# Altium schematic sheet 425AK01A_S03.SchDoc
size A3; DocumentNumber: 3; SheetNumber: 3; SheetTotal: 10; PageSetup: Record=PageOptions|CenterHorizontal=True|CenterVertical=True|PrintScale=1.01|XCorrection=1.00|YCorrection=1.00|PrintKind=1|BorderSize=5000000|LeftOffset=0|BottomOffset=0|Orientation=2|PaperLength=1000|PaperWidth=1000|Scale=100|PaperSource=15|PrintQuality=600|MediaType=1|DitherType=10|PaperKind=A3|PrintScaleMode=1; 00_Drawn: RJG; 00_Date: 11AUG2022; 00_Checked: SR; 00_Approved: GN; 00_Line1: RSB A 10MHz/50MHz Input Paths
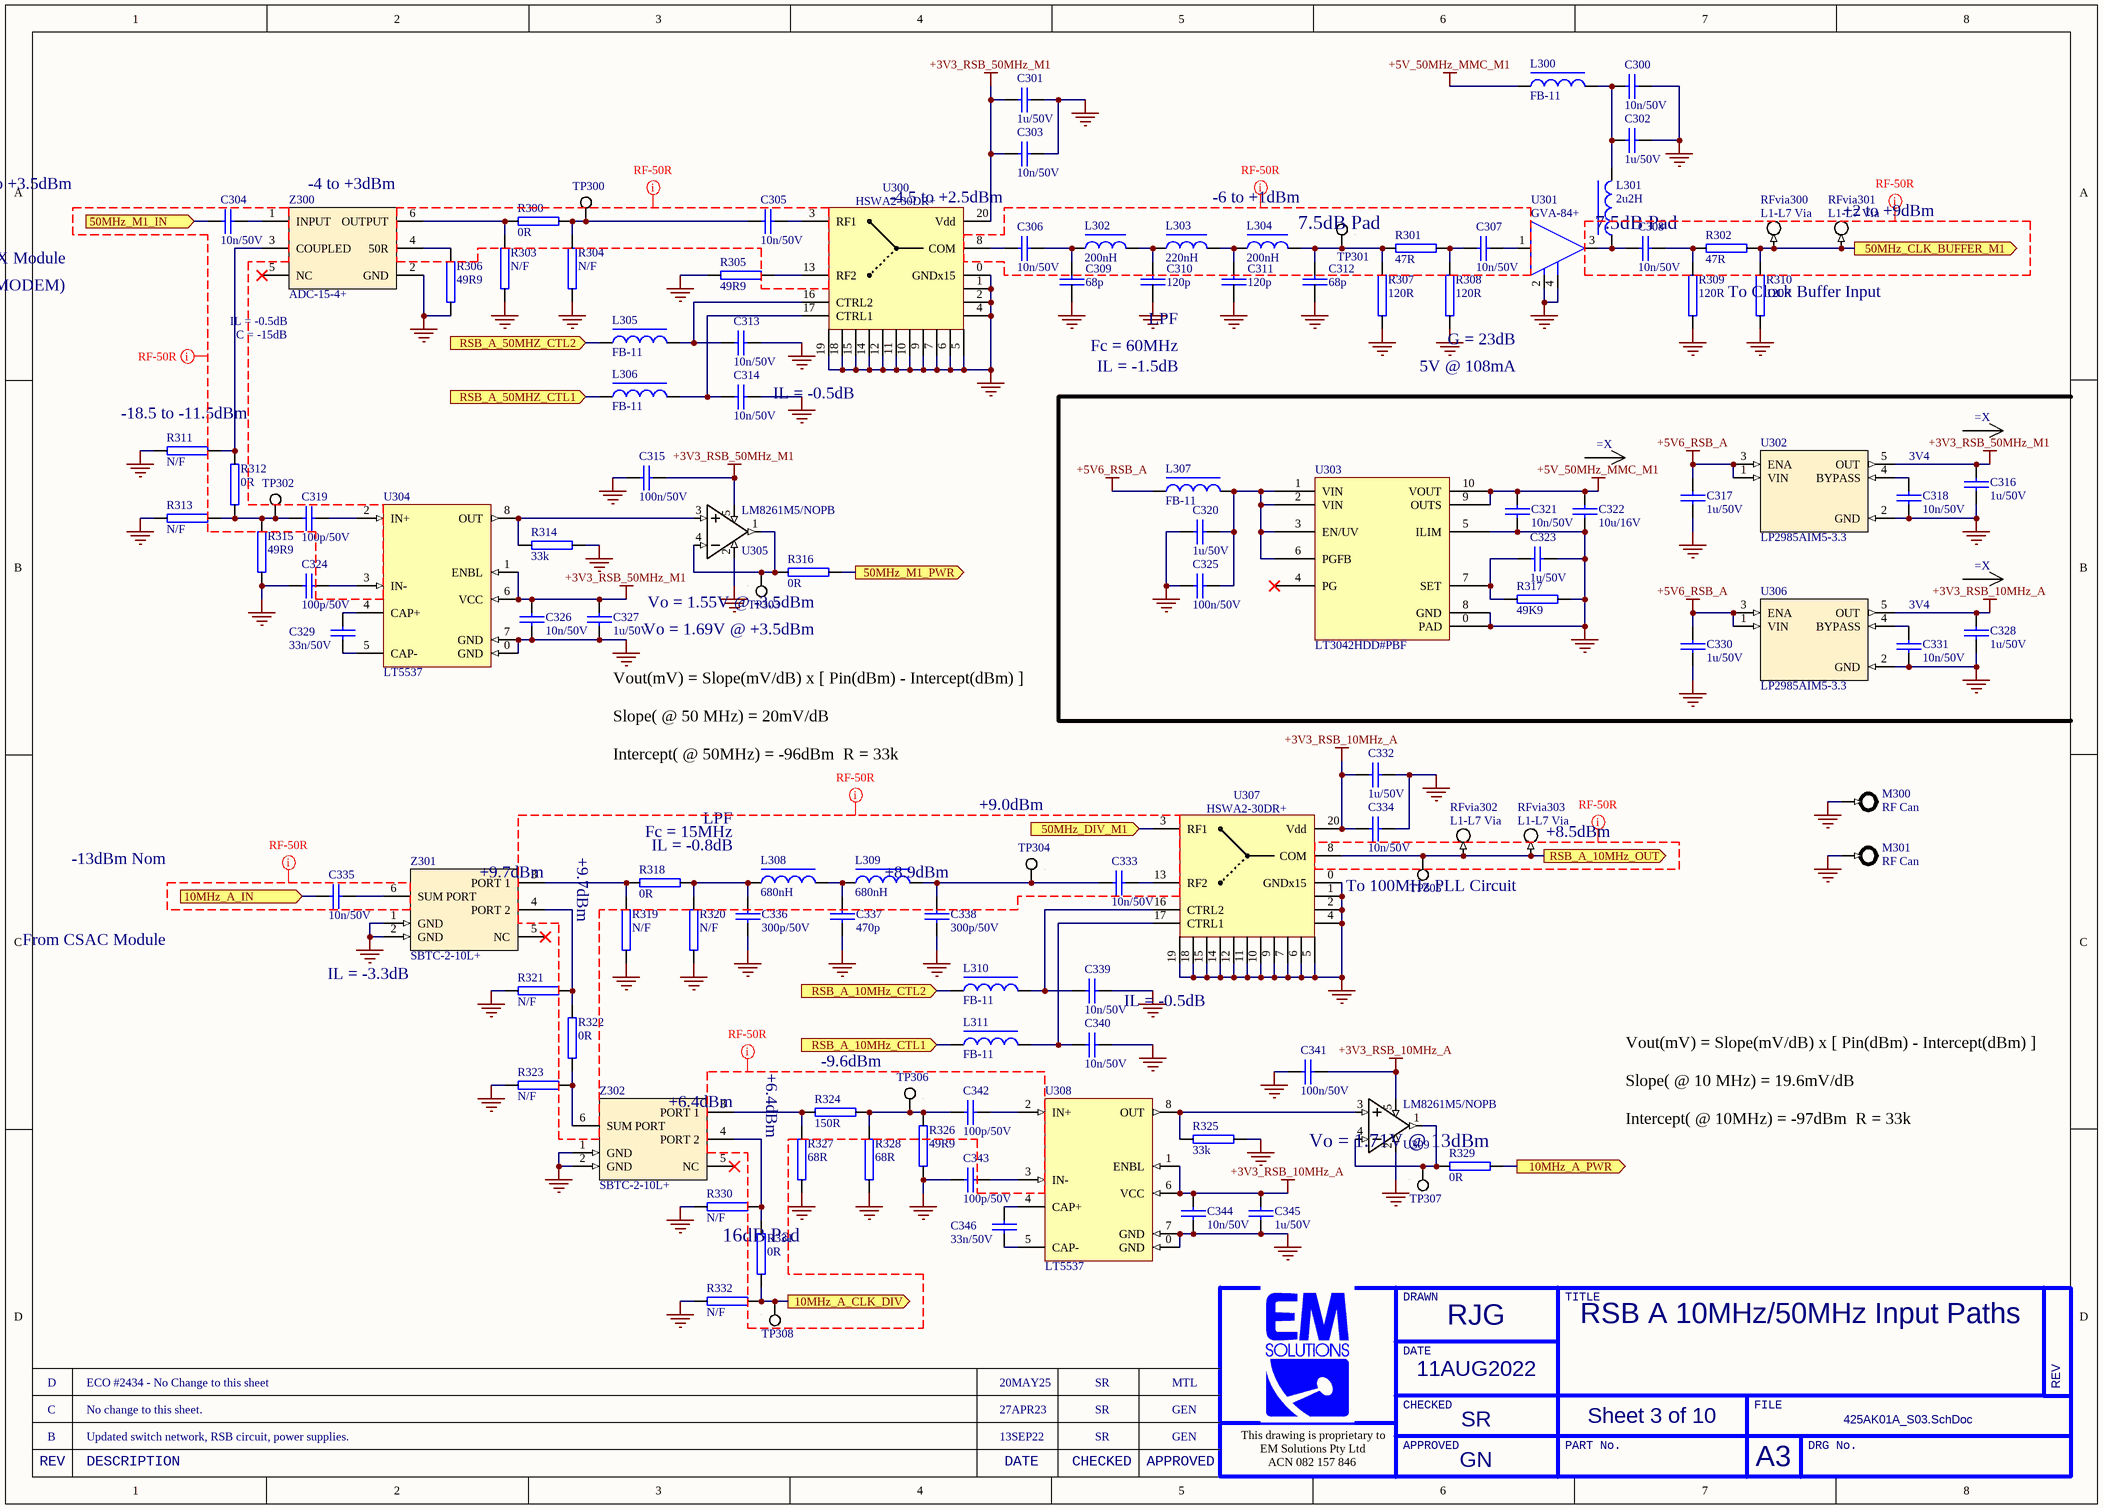
[diagram p0: 425AK01A_S03.SchDoc]

## Parts
(Parts that share a designator on the sheet are numbered #1, #2 ... from top to bottom, then left to right.)
C300  10n/50V  [0402C]
C301  1u/50V  [0603C]
C302  1u/50V  [0603C]
C303  10n/50V  [0402C]
C304  10n/50V  [0402C]
C305  10n/50V  [0402C]
C306  10n/50V  [0402C]
C307  10n/50V  [0402C]
C308  10n/50V  [0402C]
C309  68p  [0402C]
C310  120p  [0402C]
C311  120p  [0402C]
C312  68p  [0402C]
C313  10n/50V  [0402C]
C314  10n/50V  [0402C]
C315  100n/50V  [0402C]
C316  1u/50V  [0603C]
C317  1u/50V  [0603C]
C318  10n/50V  [0402C]
C319  100p/50V  [0402C]
C320  1u/50V  [0603C]
C321  10n/50V  [0402C]
C322  10u/16V  [0805C]
C323  1u/50V  [0603C]
C324  100p/50V  [0402C]
C325  100n/50V  [0402C]
C326  10n/50V  [0402C]
C327  1u/50V  [0603C]
C328  1u/50V  [0603C]
C329  33n/50V  [0402C]
C330  1u/50V  [0603C]
C331  10n/50V  [0402C]
C332  1u/50V  [0603C]
C333  10n/50V  [0402C]
C334  10n/50V  [0402C]
C335  10n/50V  [0402C]
C336  300p/50V  [0402C]
C337  470p  [0402C]
C338  300p/50V  [0402C]
C339  10n/50V  [0402C]
C340  10n/50V  [0402C]
C341  100n/50V  [0402C]
C342  100p/50V  [0402C]
C343  100p/50V  [0402C]
C344  10n/50V  [0402C]
C345  1u/50V  [0603C]
C346  33n/50V  [0402C]
GA?#1  13mA  (value not drawn)  (graphical)
GA?#2  108mA  (value not drawn)  (graphical)
GA?#3  13mA  (value not drawn)  (graphical)
L300  FB-11  [0402L]
L301  2u2H  [0805L]
L302  200nH  [0402L]
L303  220nH  [0402L]
L304  200nH  [0402L]
L305  FB-11  [0402L]
L306  FB-11  [0402L]
L307  FB-11  [0402L]
L308  680nH  [0603L]
L309  680nH  [0603L]
L310  FB-11  [0402L]
L311  FB-11  [0402L]
M300  RF Can  [Can_38x25.4x6mm]
M301  RF Can  [Can_38x25.4x6mm]
R300  0R  [0402]
R301  47R  [0402]
R302  47R  [0402]
R303  N/F  [0402]
R304  N/F  [0402]
R305  49R9  [0402]
R306  49R9  [0402]
R307  120R  [0402]
R308  120R  [0402]
R309  120R  [0402]
R310  120R  [0402]
R311  N/F  [0402]
R312  0R  [0402]
R313  N/F  [0402]
R314  33k  [0402]
R315  49R9  [0402]
R316  0R  [0402]
R317  49K9  [0402]
R318  0R  [0402]
R319  N/F  [0402]
R320  N/F  [0402]
R321  N/F  [0402]
R322  0R  [0402]
R323  N/F  [0402]
R324  150R  [0402]
R325  33k  [0402]
R326  49R9  [0402]
R327  68R  [0402]
R328  68R  [0402]
R329  0R  [0402]
R330  N/F  [0402]
R331  0R  [0402]
R332  N/F  [0402]
RFvia300  L1-L7 Via  [RFvia_L1-L7]  (no BOM)
RFvia301  L1-L7 Via  [RFvia_L1-L7]  (no BOM)
RFvia302  L1-L7 Via  [RFvia_L1-L7]  (no BOM)
RFvia303  L1-L7 Via  [RFvia_L1-L7]  (no BOM)
TP300  Pad  [Testpoint-0.5mm-SMT-withPaste]  (value not drawn)  (no BOM)
TP301  Pad  [Testpoint-0.5mm-SMT-withPaste]  (value not drawn)  (no BOM)
TP302  Pad  [Testpoint-0.5mm-SMT-withPaste]  (value not drawn)  (no BOM)
TP303  Pad  [Testpoint-0.5mm-SMT-withPaste]  (value not drawn)  (no BOM)
TP304  Pad  [Testpoint-0.5mm-SMT-withPaste]  (value not drawn)  (no BOM)
TP305  Pad  [Testpoint-0.5mm-SMT-withPaste]  (value not drawn)  (no BOM)
TP306  Pad  [Testpoint-0.5mm-SMT-withPaste]  (value not drawn)  (no BOM)
TP307  Pad  [Testpoint-0.5mm-SMT-withPaste]  (value not drawn)  (no BOM)
TP308  Pad  [Testpoint-0.5mm-SMT-withPaste]  (value not drawn)  (no BOM)
U300  HSWA2-30DR+  [DG983-1]
U301  GVA-84+  [SOT-89-RF]
U302  LP2985AIM5-3.3  [SOT-23/5]
U303  LT3042HDD#PBF  [DFN50P300X300X80_HS-11N]
U304  LT5537  [DFN-8]
U305  LM8261M5/NOPB  [SOT-23/5]
U306  LP2985AIM5-3.3  [SOT-23/5]
U307  HSWA2-30DR+  [DG983-1]
U308  LT5537  [DFN-8]
U309  LM8261M5/NOPB  [SOT-23/5]
Z300  ADC-15-4+  [ADC-15-4+]
Z301  SBTC-2-10L+  [SBTC-2-10L+]
Z302  SBTC-2-10L+  [SBTC-2-10L+]

## Ports
10MHz_A_CLK_DIV (out), 10MHz_A_IN (in), 10MHz_A_PWR (out), 50MHz_CLK_BUFFER_M1 (out), 50MHz_DIV_M1 (in), 50MHz_M1_IN (in), 50MHz_M1_PWR (out), RSB_A_10MHz_CTL1 (in), RSB_A_10MHz_CTL2 (in), RSB_A_10MHz_OUT (out), RSB_A_50MHZ_CTL1 (in), RSB_A_50MHZ_CTL2 (in)

## Nets
+3V3_RSB_10MHz_A: C328.2 C332.1 C334.1 C341.2 C344.1 C345.2 U306.5(OUT) U307.20(Vdd) U308.1(ENBL) U308.6(VCC) U309.5(V+)
+3V3_RSB_50MHz_M1: C301.1 C303.1 C315.2 C316.2 C326.1 C327.2 U300.20(Vdd) U302.5(OUT) U304.1(ENBL) U304.6(VCC) U305.5(V+)
+5V6_RSB_A: C317.2 C330.2 L307.2 U302.1(VIN) U302.3(ENA) U306.1(VIN) U306.3(ENA)
+5V_50MHz_MMC_M1: C321.2 C322.1 L300.1 U303.9(OUTS) U303.10(VOUT)
GND: C300.2 C301.2 C302.1 C303.2 C309.1 C310.1 C311.1 C312.1 C313.2 C314.2 C315.1 C316.1 C317.1 C318.1 C320.1 C321.1 C322.2 C323.2 C324.1 C325.2 C326.2 C327.1 C328.1 C330.1 C331.1 C332.2 C334.2 C336.2 C337.2 C338.2 C339.2 C340.2 C341.1 C343.1 C344.2 C345.1 M300.0 M301.0 R303.2 R304.2 R305.1 R306.1 R307.2 R308.2 R309.2 R310.2 R311.2 R313.2 R314.1 R315.1 R317.1 R319.2 R320.2 R321.2 R323.2 R325.1 R326.1 R327.2 R328.2 R330.2 R332.2 U300.0(GNDx15) U300.1(GND) U300.2(GND) U300.4(GND) U300.5(GND) U300.6(GND) U300.7(GND) U300.9(GND) U300.10(GND) U300.11(GND) U300.12(GND) U300.14(GND) U300.15(GND) U300.18(GND) U300.19(GND) U301.2 U301.4 U302.2(GND) U303.0(PAD) U303.5(ILIM) U303.8(GND) U304.0(GND) U304.7(GND) U305.2(V-) U306.2(GND) U307.0(GNDx15) U307.1(GND) U307.2(GND) U307.4(GND) U307.5(GND) U307.6(GND) U307.7(GND) U307.9(GND) U307.10(GND) U307.11(GND) U307.12(GND) U307.14(GND) U307.15(GND) U307.18(GND) U307.19(GND) U308.0(GND) U308.7(GND) U309.2(V-) Z300.2(GND) Z301.1(GND) Z301.2(GND) Z302.1(GND) Z302.2(GND)
10MHz_A_CLK_DIV: R331.1 R332.1 TP308.1 ; port 10MHz_A_CLK_DIV
10MHz_A_IN: C335.1 ; port 10MHz_A_IN
10MHz_A_PWR: R329.1 ; port 10MHz_A_PWR
50MHz_CLK_BUFFER_M1: R302.1 R310.1 RFvia300.1 RFvia301.1 ; port 50MHz_CLK_BUFFER_M1
50MHz_DIV_M1: U307.3(RF1) ; port 50MHz_DIV_M1
50MHz_M1_IN: C304.2 ; port 50MHz_M1_IN
50MHz_M1_PWR: R316.1 ; port 50MHz_M1_PWR
RSB_A_10MHz_CTL1: L311.2 ; port RSB_A_10MHz_CTL1
RSB_A_10MHz_CTL2: L310.2 ; port RSB_A_10MHz_CTL2
RSB_A_10MHz_OUT: RFvia302.1 RFvia303.1 TP305.1 U307.8(COM) ; port RSB_A_10MHz_OUT
RSB_A_50MHZ_CTL1: L306.2 ; port RSB_A_50MHZ_CTL1
RSB_A_50MHZ_CTL2: L305.2 ; port RSB_A_50MHZ_CTL2
NetC300_1: C300.1 C302.2 L300.2 L301.2
NetC304_1: C304.1 Z300.1(INPUT)
NetC305_1: C305.1 R300.1 R304.1 TP300.1
NetC305_2: C305.2 U300.3(RF1)
NetC306_1: C306.1 C309.2 L302.1
NetC306_2: C306.2 U300.8(COM)
NetC307_1: C307.1 R301.1 R308.1
NetC307_2: C307.2 U301.1
NetC308_1: C308.1 L301.1 U301.3
NetC308_2: C308.2 R302.2 R309.1
NetC310_2: C310.2 L302.2 L303.1
NetC311_2: C311.2 L303.2 L304.1
NetC312_2: C312.2 L304.2 R301.2 R307.1 TP301.1
NetC313_1: C313.1 L305.1 U300.16(CTRL2)
NetC314_1: C314.1 L306.1 U300.17(CTRL1)
NetC318_2: C318.2 U302.4(BYPASS)
NetC319_1: C319.1 R312.1 R313.1 R315.2 TP302.1
NetC319_2: C319.2 U304.2(IN+)
NetC320_2: C320.2 C325.1 L307.1 U303.1(VIN) U303.2(VIN) U303.3(EN/UV) U303.6(PGFB)
NetC323_1: C323.1 R317.2 U303.7(SET)
NetC324_2: C324.2 U304.3(IN-)
NetC329_1: C329.1 U304.5(CAP-)
NetC329_2: C329.2 U304.4(CAP+)
NetC331_2: C331.2 U306.4(BYPASS)
NetC333_1: C333.1 C338.1 L309.2 TP304.1
NetC333_2: C333.2 U307.13(RF2)
NetC335_2: C335.2 Z301.6(SUM_PORT)
NetC336_1: C336.1 L308.1 R318.1 R320.1
NetC337_1: C337.1 L308.2 L309.1
NetC339_1: C339.1 L310.1 U307.16(CTRL2)
NetC340_1: C340.1 L311.1 U307.17(CTRL1)
NetC342_1: C342.1 R324.1 R326.2 R328.1 TP306.1
NetC342_2: C342.2 U308.2(IN+)
NetC343_2: C343.2 U308.3(IN-)
NetC346_1: C346.1 U308.5(CAP-)
NetC346_2: C346.2 U308.4(CAP+)
NetR300_2: R300.2 R303.1 Z300.6(OUTPUT)
NetR305_2: R305.2 U300.13(RF2)
NetR306_2: R306.2 Z300.4(50R)
NetR311_1: R311.1 R312.2 Z300.3(COUPLED)
NetR314_2: R314.2 U304.8(OUT) U305.3(IN+)
NetR316_2: R316.2 TP303.1 U305.1(OUT) U305.4(IN-)
NetR318_2: R318.2 R319.1 Z301.3(PORT_1)
NetR321_1: R321.1 R322.2 Z301.4(PORT_2)
NetR322_1: R322.1 R323.1 Z302.6(SUM_PORT)
NetR324_2: R324.2 R327.1 Z302.3(PORT_1)
NetR325_2: R325.2 U308.8(OUT) U309.3(IN+)
NetR329_2: R329.2 TP307.1 U309.1(OUT) U309.4(IN-)
NetR330_1: R330.1 R331.2 Z302.4(PORT_2)

Not connected (* = marked no-connect by the designer): U303 4(PG)*; Z300 5(NC)*; Z301 5(NC)*; Z302 5(NC)*

## Layout directives
net class RF-50R: (no net found under the mark)

## Notes on the sheet
- (near C304) -3.5 to +3.5dBm
- -4 to +3dBm
- -4.5 to +2.5dBm
- -6 to +1dBm
- 7.5dB Pad
- +2 to +9dBm
- (near C304) From TX Module
- (GX MODEM)
- To Clock Buffer Input
- (near Z300) IL = -0.5dB
- C = -15dB
- LPF
- Fc = 60MHz
- IL = -1.5dB
- G = 23dB
- 5V @ 108mA
- -18.5 to -11.5dBm
- IL = -0.5dB
- 3V4
- (near R316) Vo = 1.55V @ -3.5dBm
- Vo = 1.69V @ +3.5dBm
- (near C327) Vout(mV) = Slope(mV/dB) x [ Pin(dBm) - Intercept(dBm) ]
  Slope( @ 50 MHz) = 20mV/dB
  Intercept( @ 50MHz) = -96dBm  R = 33k
- Fc = 15MHz
- IL = -0.8dB
- +9.0dBm
- +8.5dBm
- -13dBm Nom
- +9.7dBm
- (near R321) +9.7dBm
- +8.9dBm
- (near RFvia303) To 100MHz PLL Circuit
- (near C335) From CSAC Module
- (near R321) IL = -3.3dB
- +6.4dBm
- -9.6dBm
- Vout(mV) = Slope(mV/dB) x [ Pin(dBm) - Intercept(dBm) ]
  Slope( @ 10 MHz) = 19.6mV/dB
  Intercept( @ 10MHz) = -97dBm  R = 33k
- (near R329) Vo = 1.71V @ 13dBm
- 16dB Pad
- D
- ECO #2434 - No Change to this sheet
- 20MAY25
- SR
- MTL
- B
- C
- Updated switch network, RSB circuit, power supplies.
- No change to this sheet.
- 13SEP22
- 27APR23
- GEN
- DRAWN
- TITLE
- DATE
- REV
- This drawing is proprietary to
- EM Solutions Pty Ltd
- APPROVED
- CHECKED
- PART No.
- FILE
- A3
- DRG No.
- DESCRIPTION
- ACN 082 157 846

## Library data of the parts
C300 C307 C308 C326 C344 = 41-010N-12: Capacitor, 0402, 10n X7R 10% 50V Ceramic, NiSn; MANUFACTURER: MURATA; MODELNAME: GCM155R71H103KA55D; ID: 2217; Part Number: 41-010N-12; ItemID: 41-010N-12
C301 C302 C327 C332 C345 = 41-01U0-06: Capacitor, 0603, 1u X7R 10% 50V Ceramic, NiSn; MANUFACTURER: TAIYOYUDEN; ID: 2287; MODELNAME: UMK107AB7105KA; Part Number: 41-01U0-06; ItemID: 41-01U0-06
C303-C306 C313 C314 C318 C321 C331 C333-C335 C339 C340 = 41-010N-12: Capacitor, 0402, 10n X7R 10% 50V Ceramic, NiSn; MANUFACTURER: MURATA; ID: 2217; MODELNAME: GCM155R71H103KA55D; Part Number: 41-010N-12; ItemID: 41-010N-12
C309 C312 = 41-068P-08: Capacitor, 0402, 68p; Part Number: 41-068P-08
C310 C311 = 41-120P-05: Capacitor, 0402, 120p NPO; Part Number: 41-120P-05
C315 C325 C341 = 41-100N-13: Capacitor, 0402, 100n, X7R, 10% 50V, Ceramic; MANUFACTURER: MURATA; ID: 2441; MODELNAME: GRM155R71H104KE14J; Part Number: 41-100N-13; ItemID: 41-100N-13
C316 C317 C320 C323 C328 C330 = 41-01U0-06: Capacitor, 0603, 1u X7R 10% 50V Ceramic, NiSn; MANUFACTURER: TAIYOYUDEN; MODELNAME: UMK107AB7105KA; ID: 2287; Part Number: 41-01U0-06; ItemID: 41-01U0-06
C319 C324 C342 C343 = 41-100P-11: Capacitor, 0402, 100p NPO 5% 50V Ceramic, AEC-Q200; MANUFACTURER: TDK; ID: 2448; MODELNAME: CGA2B2C0G1H101J050BA; Part Number: 41-100P-11; ItemID: 41-100P-11
C322 = 41-010U-08: Capacitor, 0805, 10u X7R 10% 16V Ceramic, NiSn; MANUFACTURER: SAMSUNG; ID: 2232; MODELNAME: CL21B106KOQNNNE; Part Number: 41-010U-08; ItemID: 41-010U-08
C329 C346 = 41-033N-01: *Capacitor, 0402, 33n, X7R, 10%, 50V; Part Number: 41-033N-01
C336 C338 = 41-300P-01: Capacitor, 0402, 300p NPO 5% 50V Ceramic, NiSn; MANUFACTURER: MURATA; ID: 2478; MODELNAME: GRM1555C1H301JA01D; Part Number: 41-300P-01; ItemID: 41-300P-01
C337 = 41-470P-08: Capacitor, 0402, 470p ,NPO. 5% 50V Ceramic, NiSn; MANUFACTURER: MURATA; ID: 2499; MODELNAME: GRM1555C1H471JA01D; Part Number: 41-470P-08; ItemID: 41-470P-08
GA?#1-GA?#3 = Graphical-Current-Arrow
  GA?#1 GA?#3: X: 13mA
  GA?#2: X: 108mA
L300 = 46-B-11: Solid Inductor, 600ohm@100MHz, DCR=0.52, 0.3A, 0402 size; MANUFACTURER: TDK; ID: 3256; MODELNAME: MMZ1608B301CTAH0; Part Number: 46-B-11; ItemID: 46-B-11
L301 = 46-02U2-01: Inductor, Chip, 2u2H 10%, 0805, SIMID08B Series; MANUFACTURER: SIEMENS; MODELNAME: B82498-B3222-K; Part Number: 46-02U2-01; Category: EMS Parts Master
L302 L304 = 46-200N-04: Inductor, Chip, 200nH, 0402; Part Number: 46-200N-04
L303 = 46-220N-05: Inductor, Chip, 220nH, 0402; Part Number: 46-220N-05
L305-L307 L310 L311 = 46-B-11: Solid Inductor, 600ohm@100MHz, DCR=0.52, 0.3A, 0402 size; MANUFACTURER: TDK; MODELNAME: MMZ1005S601C; ID: 3256; Part Number: 46-B-11; ItemID: 46-B-11
L308 L309 = 46-680N-02: Inductor, Chip, 680nH, 2%, 0603, 470mA, SRF=260MHz, 0603LS Series; MANUFACTURER: COILCRAFT; ID: 3246; MODELNAME: 0603LS-681XGLB; Part Number: 46-680N-02; ItemID: 46-680N-02
M300 M301 = Can-RF: Part Number: 11-0256
R300 R312 R316 R318 R322 R329 R331 = 44-000R-10: Resistor, 0402, 0R 1% 0.063W; MANUFACTURER: GENERIC; ID: 2538; Part Number: 44-000R-10; ItemID: 44-000R-10; MODELNAME: GENERIC
R301 R302 = 44-047R-10: Resistor, 0402, 47R 1% 0.063W; ID: 2786; Part Number: 44-047R-10; ItemID: 44-047R-10
R303 R304 R311 R313 R319-R321 R323 R330 R332 = 44-N/F-10: Resistor, 0402, SOT, Not Fitted; ID: 3111; Part Number: 44-N/F-10; ItemID: 44-N/F-10
R305 R306 R315 R326 = 44-049R9-10: Resistor, 0402, 49R9 1% 0.063W; ID: 2787; MODELNAME: RC0402FR-0749R9L; Part Number: 44-049R9-10; ItemID: 44-049R9-10
R307-R310 = 44-120R-10: Resistor, 0402, 120R 1% 0.063W; MANUFACTURER: GENERIC; ID: 2950; Part Number: 44-120R-10; ItemID: 44-120R-10; MODELNAME: GENERIC
R314 R325 = 44-033K-10: Resistor, 0402, 33k 1% 0.063W; MANUFACTURER: PHILIPS; ID: 2720; MODELNAME: RC32H; Part Number: 44-033K-10; ItemID: 44-033K-10
R317 = 44-49K9-01: Resistor, 0402, 49.9K, 1%, 0.1W, ThickFilm, AEC-Q200; MANUFACTURER: PANASONIC; MODELNAME: ERJ-2RKF4992X; ID: 3061; Part Number: 44-49K9-01; ItemID: 44-49K9-01
R324 = 44-150R-10: Resistor, 0402, 150R 1% 0.063W; MANUFACTURER: GENERIC; ID: 2966; Part Number: 44-150R-10; ItemID: 44-150R-10; MODELNAME: GENERIC
R327 R328 = 44-068R-10: Resistor, 0402, 68R 1% 0.063W; MANUFACTURER: GENERIC; ID: 2849; Part Number: 44-068R-10; ItemID: 44-068R-10; MODELNAME: GENERIC
RFvia300-RFvia303 = RFvia_L1-L7: RF Via from layer 1 to layer 7, on an 8-layer board.; Rule: UNIONINDEX=0|RULEKIND=PlaneClearance|NETSCOPE=AnyNet|LAYERKIND=SameLayer|NAME=Schematic Power Plane Clearance|CLEARANCE=13.7795mil|UNIT=Imperial
TP300-TP308 = Pad: Pad that can be a test point or a hot via
U300 U307 = HSWA2-30DR+: RF Switch, SPDT, DC-3GHz, Absorptive, IL=1dB, I=60dB, P=30dBm, 2V7-3V3, 4x4 QFN; MANUFACTURER: MINICCTS; ID: 3484; Part Number: 54-30-01; MODELNAME: HSWA2-30DR+; ItemID: 54-30-01
U301 = GVA-84+: MMIC, DC-7GHz, G=24dB, P1dB=20.5dBm, SOT-89; Part Number: 58-GVA84-01
U302 U306 = Regulator-Linear-3V3-LP2985: Volt Regulator, 3.3V, 150mA, LoNoise, LDO, SOT-23/5; Part Number: 52-2985-06; MPN: LP2985AIM5-3.3/NOPB; Manufacturer: Texas Instruments
U303 = 52-3042-01: Volt Regulator, Vin=1.8-20V, Vin=0-15V, 200mA, Low Noise, -40to+125C; MANUFACTURER: ANLG DEV; MODELNAME: LT3042IDD#PBF; ID: 3361; Part Number: 52-3042-01; ItemID: 52-3042-01
U304 U308 = LT5537EDDB: RF Detector, 10-1000MHz, 83dB, -40/+85C, 8-DFN 3x2mm; Part Number: 54-5537-01; MPN: LT5537EDDB
U305 U309 = OpAmp-LM8261: Opamp, RRIO, 2V5 to 30V supply, 21MHz GBWP; Part Number: 52-8621-01
Z300 = 33-0058: Directional Coupler, C=15.5dB, 5-1000MHz, SM; MANUFACTURER: MINICCTS; ID: 2077; Part Number: 33-0058; MODELNAME: ADC-15-4+; ItemID: 33-0058
Z301 Z302 = 33-0055: Divider/Combiner, 2 Way, 0 deg, 10 -1000MHz, Tx Line Tranformer; MANUFACTURER: MINICCTS; ID: 2075; Part Number: 33-0055; ItemID: 33-0055; MODELNAME: SBTC-2-10L+